# EAGLE design sparkfantutorial (EAGLE 7.5.0)
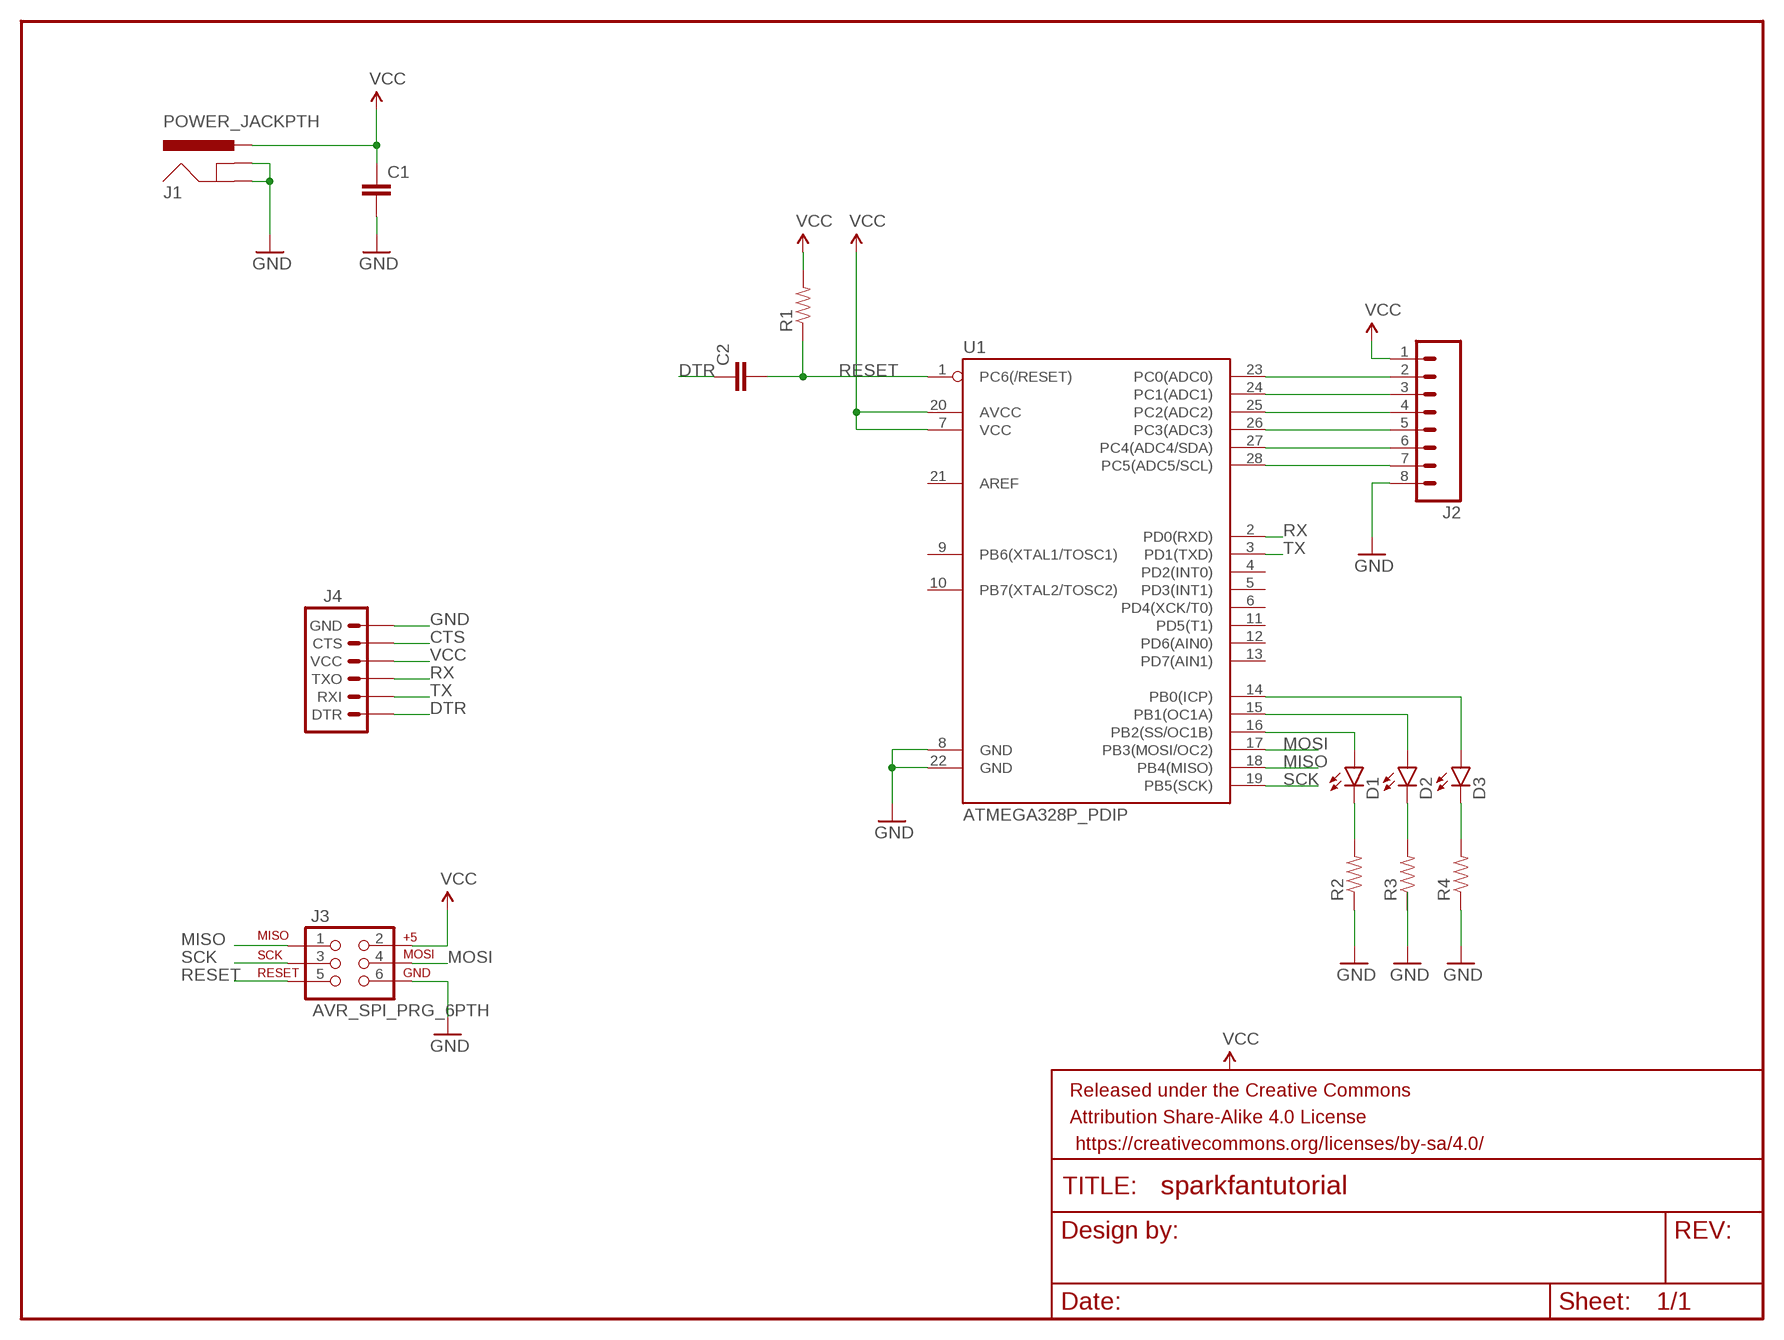
[diagram p0: schematic, sheet 1]

## Parts
C1  CAPPTH  [CAP-PTH-SMALL]
C2  CAPPTH  [CAP-PTH-SMALL]
D1  LED5MM  [LED5MM]
D2  LED5MM  [LED5MM]
D3  LED5MM  [LED5MM]
FRAME1  FRAME-LETTER  [CREATIVE_COMMONS]
J1  POWER_JACKPTH  [POWER_JACK_PTH]
J2  M08  [1X08_ROUND]
J3  AVR_SPI_PRG_6PTH  [2X3]
J4  ARDUINO_SERIAL_PROGRAMPTH  [1X06]
R1  RESISTORPTH-1/4W  [AXIAL-0.4]
R2  RESISTORPTH-1/4W  [AXIAL-0.4]
R3  RESISTORPTH-1/4W  [AXIAL-0.4]
R4  RESISTORPTH-1/4W  [AXIAL-0.4]
U1  ATMEGA328P_PDIP  [DIL28-3]

## Nets
CTS: J4.5(CTS)
DTR: C2.1 J4.1(DTR)
GND: C1.2 J1.GND J1.GNDBREAK J2.8 J3.6 J4.6(GND) R2.P$1 R4.P$1 U1.8(GND) U1.22(GND)
MISO: J3.1 U1.18(PB4(MISO))
MOSI: J3.4 U1.17(PB3(MOSI/OC2))
N$1: D1.K(C) R2.P$2
N$2: D1.A U1.16(PB2(SS/OC1B))
N$3: D2.A U1.15(PB1(OC1A))
N$4: D3.A U1.14(PB0(ICP))
N$5: J2.2 U1.23(PC0(ADC0))
N$6: J2.3 U1.24(PC1(ADC1))
N$7: J2.4 U1.25(PC2(ADC2))
N$8: J2.5 U1.26(PC3(ADC3))
N$9: J2.6 U1.27(PC4(ADC4/SDA))
N$10: J2.7 U1.28(PC5(ADC5/SCL))
N$11: D2.K(C) R3.P$2
N$12: D3.K(C) R4.P$2
RESET: C2.2 J3.5 R1.P$1 U1.1(PC6(/RESET))
RX: J4.3(TXO) U1.2(PD0(RXD))
SCK: J3.3 U1.19(PB5(SCK))
TX: J4.2(RXI) U1.3(PD1(TXD))
VCC: C1.1 J1.PWR J2.1 J3.2 J4.4(VCC) R1.P$2 U1.7(VCC) U1.20(AVCC)
Unconnected: R3.P$1 U1.4(PD2(INT0)) U1.5(PD3(INT1)) U1.6(PD4(XCK/T0)) U1.9(PB6(XTAL1/TOSC1)) U1.10(PB7(XTAL2/TOSC2)) U1.11(PD5(T1)) U1.12(PD6(AIN0)) U1.13(PD7(AIN1)) U1.21(AREF)

## Library data of the parts
C1 C2 = SparkFun-Capacitors:CAP: Capacitor Standard 0603 ceramic capacitor, and 0.1" leaded capacitor.
D1-D3 = SparkFun-LED:LED: LEDs Standard schematic elements and footprints for 5mm, 3mm, 1206, and 0603 sized LEDs. 5mm - Spark Fun Electronics SKU : COM-00529 (and others)
FRAME1 = SparkFun-Aesthetics:FRAME-LETTER: Schematic Frame Standard 8.5x11 US Letter frame
J1 = SparkFun-Connectors:POWER_JACK: Power Jack This is the standard 5.5mm barrel jack for power. The PTH is the most common, proven, reliable, footprint. The Slot footprint only works if the mill layer is transmitted to the PCB fab house so be warned. Mating wall wart : TOL-00298 (and others); PROD_ID: CONN-08197
J2 = SparkFun-Connectors:M08: Header 8 Standard 8-pin 0.1" header. Use with straight break away headers (SKU : PRT-00116), right angle break away headers (PRT-00553), swiss pins (PRT-00743), machine pins (PRT-00117), and female headers (PRT-00115).; PROD_ID: CONN-08437
J3 = SparkFun-Connectors:AVR_SPI_PRG_6: AVR ISP 6 Pin This is the reduced ISP connector for AVR programming. Common on Arduino. This footprint will take up less PCB space and can be used with a 10-pin to 6-pin adapter such as SKU: BOB-08508 **Special note about "TEST_POINT" package. The stop mask is on the top side, so if you want your programming test points to be on the bottom of your board, make sure to place this package on the bottom side of the board. This also ensure that the orientation to program from the bottom side will be correct.
J4 = SparkFun-Connectors:ARDUINO_SERIAL_PROGRAM: FTDI connector footprints
R1-R4 = SparkFun-Resistors:RESISTOR: Resistor Basic schematic elements and footprints for 0603, 1206, and PTH resistors.
U1 = SparkFun-DigitalIC:ATMEGA328P_PDIP: uC used in the Arduino 32kb flash, 1k EEPROM, 2k SRAM This is the through-hole version of this chip.

## Net classes
0 default: width 0.5 mm

## Board
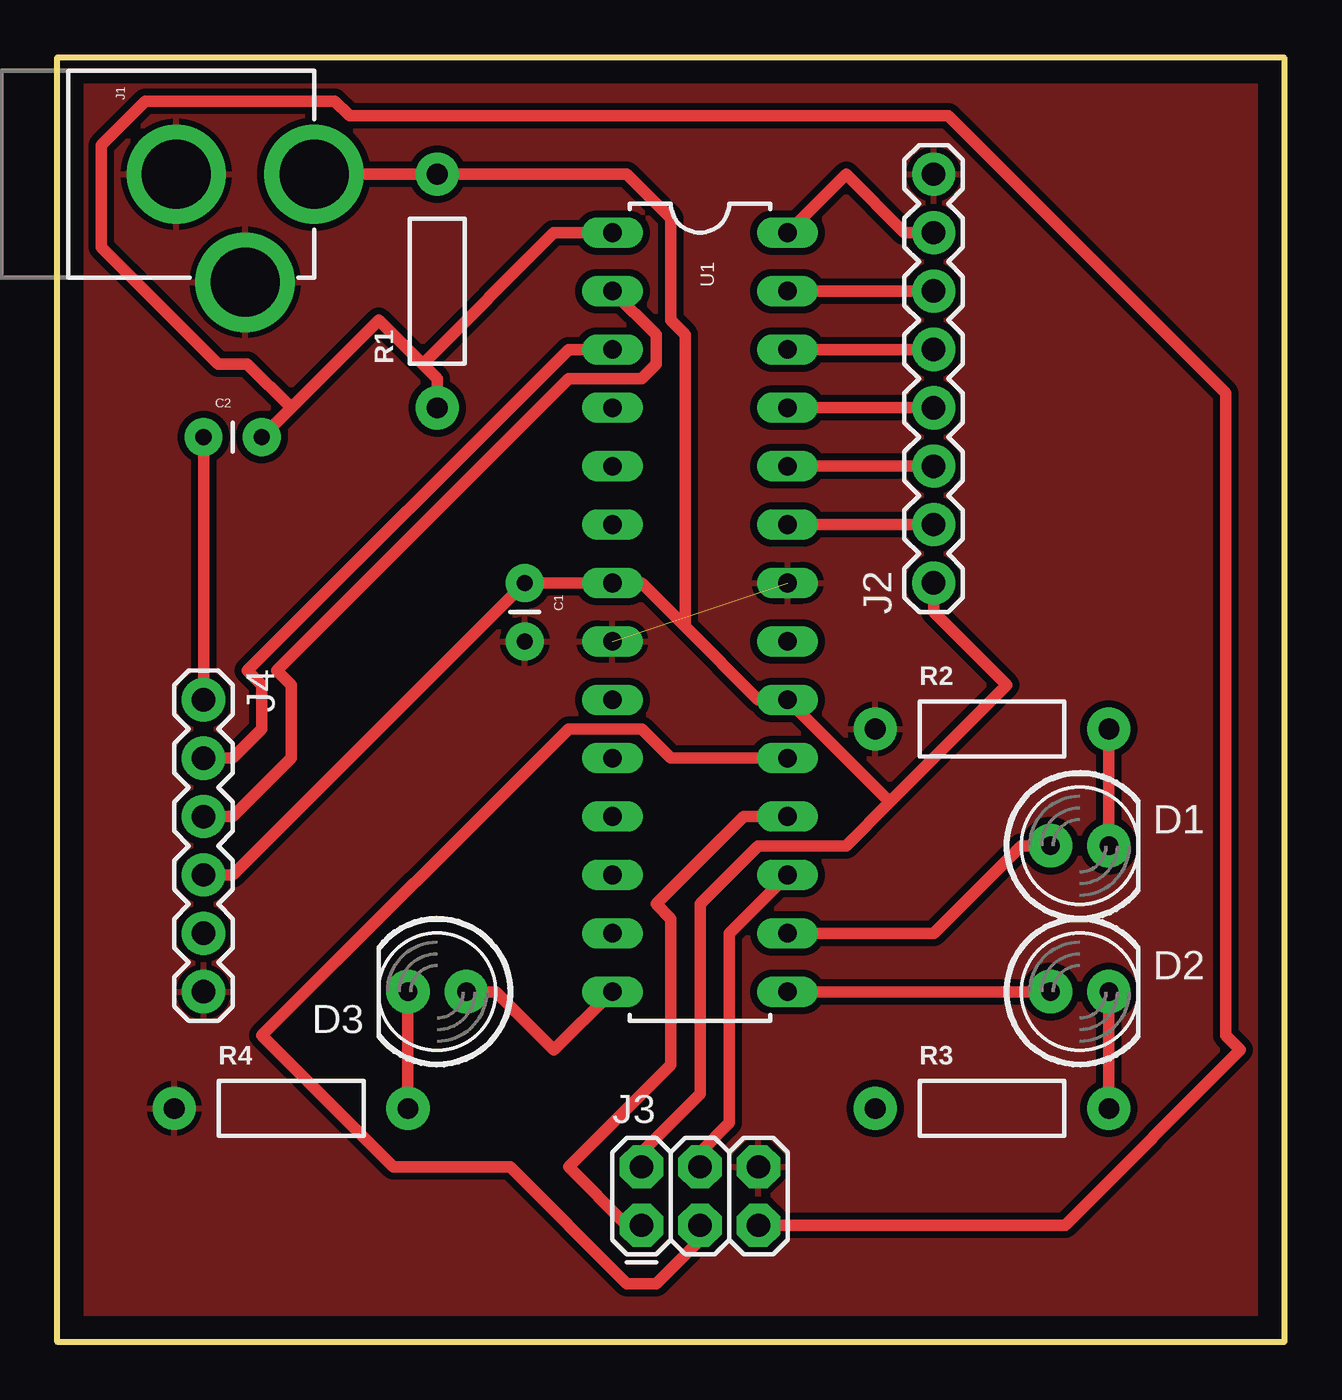
[diagram p1: board, top side]

Size 53.34 x 55.88 mm. Coordinates in mm from the lower left corner, seen from the top.
Outline: 0,0 0,55.88 53.34,55.88 53.34,0 0,0
Copper layers (1*16): Top 0.035mm / dielectric 1.5mm / Bottom 0.035mm
Design rules "default": minimum track width 10mil, minimum drill 24mil, track to track 8mil, track to pad 8mil, pad to pad 8mil, via to via 8mil, smd to smd 8mil, copper to edge 40mil, drill to drill 8mil, minimum pad ring 10mil, minimum via ring 8mil, stop-mask expansion 4mil, vias tented up to drill 0mil, thermal gap 10mil

### Footprints (pad centres in the part's own frame; a part is rotated, then mirrored left to right if it is on the bottom)
CAP-PTH-SMALL = drill 0.7 pad 1.651: 1 0,0; 2 2.54,0
LED5MM = drill 0.813 pad 1.88: A -1.27,0; K 1.27,0
POWER_JACK_PTH = drill 2.997 pad 4.318: GND 0,7.7; GNDBREAK 4.7,10.7; PWR 0,13.7
1X08_ROUND = drill 1.016 pad 1.88: 1 0,0; 2 2.54,0; 3 5.08,0; 4 7.62,0; 5 10.16,0; 6 12.7,0; 7 15.24,0; 8 17.78,0
2X3 = drill 1.016 pad 1.88 octagon: 1 0,0; 2 0,2.54; 3 2.54,0; 4 2.54,2.54; 5 5.08,0; 6 5.08,2.54
1X06 = drill 1.016 pad 1.88: 1 0,0; 2 2.54,0; 3 5.08,0; 4 7.62,0; 5 10.16,0; 6 12.7,0
AXIAL-0.4 = drill 0.9 pad 1.88: P$1 -5.08,0; P$2 5.08,0
DIL28-3 = drill 0.813 long: 1 -16.51,-3.81; 2 -13.97,-3.81; 3 -11.43,-3.81; 4 -8.89,-3.81; 5 -6.35,-3.81; 6 -3.81,-3.81; 7 -1.27,-3.81; 8 1.27,-3.81; 9 3.81,-3.81; 10 6.35,-3.81; 11 8.89,-3.81; 12 11.43,-3.81; 13 13.97,-3.81; 14 16.51,-3.81; 15 16.51,3.81; 16 13.97,3.81; 17 11.43,3.81; 18 8.89,3.81; 19 6.35,3.81; 20 3.81,3.81; 21 1.27,3.81; 22 -1.27,3.81; 23 -3.81,3.81; 24 -6.35,3.81; 25 -8.89,3.81; 26 -11.43,3.81; 27 -13.97,3.81; 28 -16.51,3.81

### Placement (x,y rotation side)
C1  20.32,33.02 270 top
C2  6.35,39.37 0 top
D1  44.45,21.59 0 top
D2  44.45,15.24 0 top
D3  16.51,15.24 180 top
FRAME1  -101.6,41.91 0 top  (outside the outline)
J1  -2.54,50.8 270 top
J2  38.1,33.02 90 top
J3  25.4,5.08 0 top
J4  6.35,27.94 270 top
R1  16.51,45.72 90 top
R2  40.64,26.67 0 top
R3  40.64,10.16 0 top
R4  10.16,10.16 0 top
U1  27.94,31.75 270 top

### Tracks (layer width: path | path; a pad name or v marks a point on that pad's centre or on a via)
DTR
  Top 0.5: J4.1 C2.1
GND  (1 unrouted)
  pour Top (isolate 0.305): 0,0 0,55.88 53.34,55.88 53.34,0
MISO
  Top 0.5: U1.18 29.84,22.86 26.04,19.05 26.67,18.41 26.67,12.06 22.23,7.62 24.77,5.08 J3.1
MOSI
  Top 0.5: U1.17 29.21,17.78 29.21,9.53 27.94,8.26 J3.4
N$1
  Top 0.5: R2.P$2 D1.K
N$2
  Top 0.5: U1.16 38.1,17.78 41.91,21.59 D1.A
N$3
  Top 0.5: D2.A U1.15
N$4
  Top 0.5: U1.14 21.59,12.7 19.05,15.24 D3.A
N$5
  Top 0.5: J2.2 U1.23
N$6
  Top 0.5: J2.3 U1.24
N$7
  Top 0.5: J2.4 U1.25
N$8
  Top 0.5: J2.5 U1.26
N$9
  Top 0.5: J2.6 U1.27
N$10
  Top 0.5: U1.28 34.29,50.8 36.83,48.26 J2.7
N$11
  Top 0.5: D2.K R3.P$2
N$12
  Top 0.5: D3.K R4.P$2
RESET
  Top 0.5: U1.1 21.59,48.26 15.88,42.55 | 15.88,42.55 16.51,41.91 R1.P$1 | 10.16,40.64 13.97,44.45 15.88,42.55 | 10.16,40.64 C2.2 | J3.5 43.81,5.08 51.44,12.7 50.8,13.34 50.8,41.27 38.73,53.34 12.7,53.34 12.06,53.98 3.81,53.98 1.91,52.07 1.91,47.62 6.99,42.55 8.26,42.55 10.16,40.64
RX
  Top 0.5: U1.2 26.04,43.81 26.04,42.55 25.4,41.91 22.23,41.91 9.53,29.21 10.16,28.57 10.16,25.4 7.62,22.86 J4.3
SCK
  Top 0.5: U1.19 26.67,25.4 25.4,26.67 22.23,26.67 8.89,13.34 14.61,7.62 19.68,7.62 24.77,2.54 26.04,2.54 27.94,4.45 J3.3
TX
  Top 0.5: U1.3 22.23,43.18 8.26,29.21 8.89,28.57 8.89,26.67 7.62,25.4 J4.2
VCC
  Top 0.5: J3.2 25.4,8.26 27.94,10.79 27.94,19.05 30.48,21.59 34.29,21.59 36.2,23.5 | 36.2,23.5 41.27,28.57 38.1,31.75 J2.1 | J1.PWR R1.P$2 24.77,50.8 26.67,48.9 26.67,44.45 27.3,43.81 27.3,31.11 | 27.3,31.11 25.4,33.02 U1.7 C1.1 7.62,20.32 J4.4 | 27.3,31.11 30.48,27.94 U1.20 36.2,23.5